# EAGLE schematic CT-ARM (EAGLE 7.4.0)
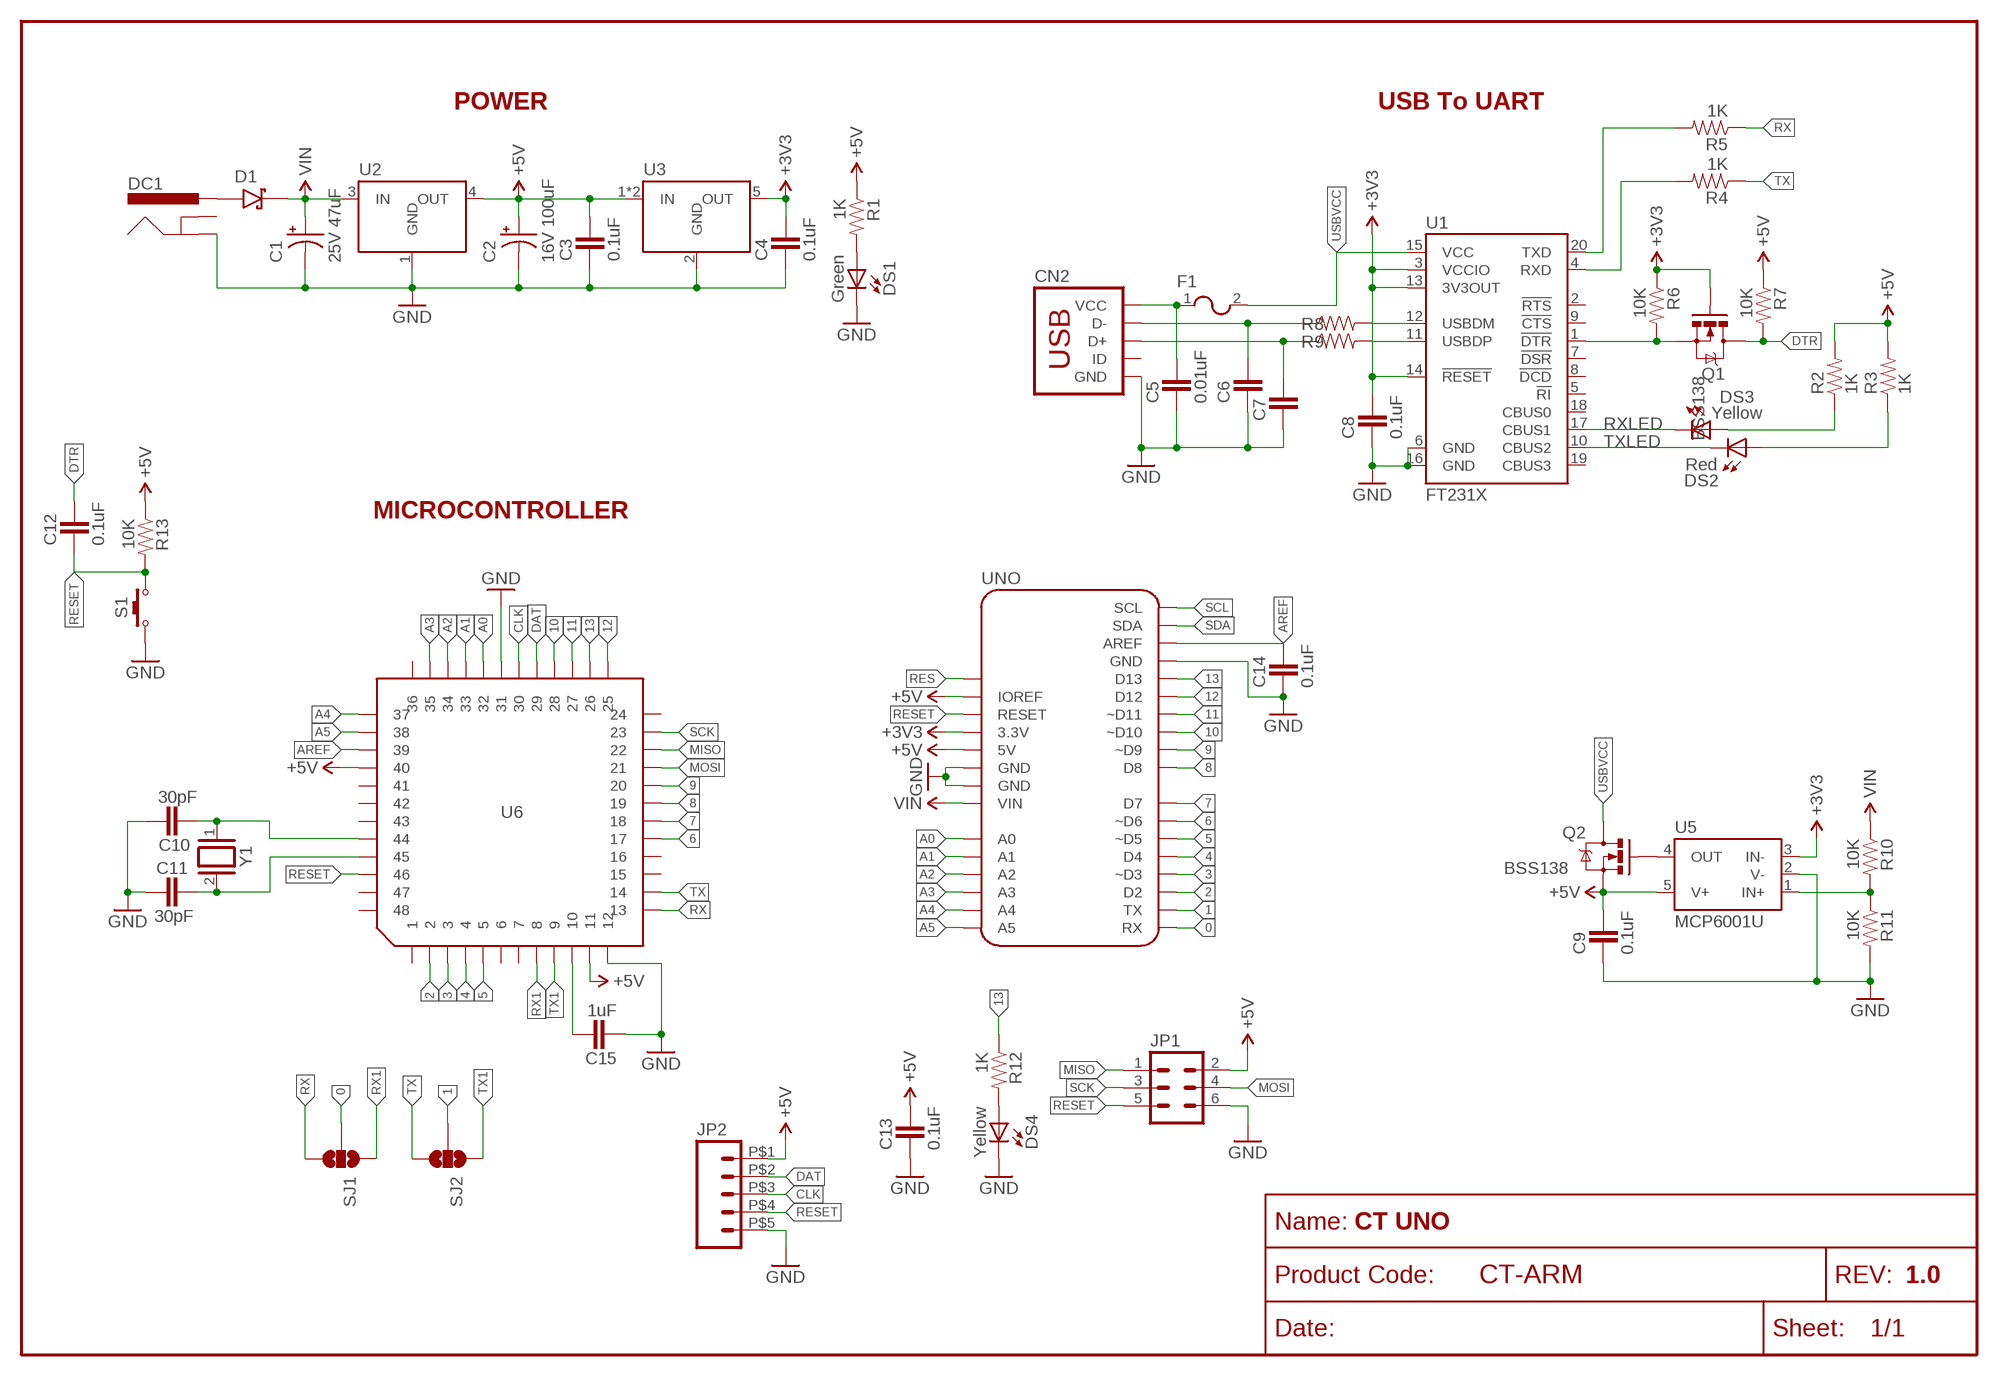
[diagram p0: schematic, sheet 1]

## Parts
C1  25V 47uF  CAP-E-ALUMINIUM_25V47UF_(CHEMICON-F55)  [ECAP-CHEMICON-F]
C2  16V 100uF  CAP-E-ALUMINIUM_16V100UF_(CHEMICON-F55)  [ECAP-CHEMICON-F]
C3  0.1uF  CAP-C_0.1UF_(2012)  [2012]
C4  0.1uF  CAP-C_0.1UF_(2012)  [2012]
C5  0.01uF  CAP-C_0.01UF_(2012)  [2012]
C6  CAP-C_(2012)  [2012]
C7  CAP-C_(2012)  [2012]
C8  0.1uF  CAP-C_0.1UF_(2012)  [2012]
C9  0.1uF  CAP-C_0.1UF_(2012)  [2012]
C10  30pF  CAP-C_30PF_(2012)  [2012]
C11  30pF  CAP-C_30PF_(2012)  [2012]
C12  0.1uF  CAP-C_0.1UF_(2012)  [2012]
C13  0.1uF  CAP-C_0.1UF_(2012)  [2012]
C14  0.1uF  CAP-C_0.1UF_(2012)  [2012]
C15  1uF  CAP-C_1UF_(2012)  [2012]
CN2  USB-5PIN_(MICRO-B-REC)  [USB-MICRO-B-REC]
D1  40V 1A  DIODE-SCHOTTKY_MBRA140T_(SMA)  [D-SMA]
DC1  DC_POWER_JACK_(PTH)  [DC_PLUG_PTH]
DS1  Green  LED_GREEN_(3216)  [LED-3216]
DS2  Red  LED_RED_(3216)  [LED-3216]
DS3  Yellow  LED_YELLOW_(3216)  [LED-3216]
DS4  Yellow  LED_YELLOW_(3216)  [LED-3216]
F1  500mA  FUSE_(4532)  [4532]
JP1  3/40 Ways  HEADER-2X03_(MALE)  [HDR-M2X03]
JP2  HEADER-1X05_(NOSILK)  [HDR-M1X05-NOSILK]
Q1  50V 220mA  MOSFET-N_BSS138_(SOT-23)  [SOT-23]
Q2  50V 220mA  MOSFET-N_BSS138_(SOT-23)  [SOT-23]
R1  1K  RESISTOR_1K_(2012)  [2012]
R2  1K  RESISTOR_1K_(2012)  [2012]
R3  1K  RESISTOR_1K_(2012)  [2012]
R4  1K  RESISTOR_1K_(2012)  [2012]
R5  1K  RESISTOR_1K_(2012)  [2012]
R6  10K  RESISTOR_10K_(2012)  [2012]
R7  10K  RESISTOR_10K_(2012)  [2012]
R8  RESISTOR_(2012)  [2012]
R9  RESISTOR_(2012)  [2012]
R10  10K  RESISTOR_10K_(2012)  [2012]
R11  10K  RESISTOR_10K_(2012)  [2012]
R12  1K  RESISTOR_1K_(2012)  [2012]
R13  10K  RESISTOR_10K_(2012)  [2012]
S1  SW-PB_(KAN0444)  [S-SW-PBM-KAN0444]
SJ1  SOLDERJUMPER_2WAYS  [SJ_3]
SJ2  SOLDERJUMPER_2WAYS  [SJ_3]
U1  FT231XS  [SSOP20_L]
U2  5V  VREG_1117-5.0_(DPAK-GOI)  [DPAK]
U3  3.3V 500mA  VREG_(SOT-23-5)  [SOT-23-5]
U5  5 Pins  MCP6001U_(SOT)  [SOT-23-5]
U6  NUC-48PIN_(48PIN)  [LQFP48]
UNO  ARDUINO-UNO-SHEILD_(UNO)  [ARDUINO-UNO-SHIELD]
Y1  XTAL_(SMD-HC49UP)  [XTAL-HC49UP]

## Nets
0: SJ1.2 UNO.15(RX)
1: SJ2.2 UNO.16(TX)
2: U6.2 UNO.17(D2)
3: U6.3 UNO.18(~D3)
4: U6.4 UNO.19(D4)
5: U6.5 UNO.20(~D5)
6: U6.17 UNO.21(~D6)
7: U6.18 UNO.22(D7)
8: U6.19 UNO.23(D8)
9: U6.20 UNO.24(~D9)
10: U6.28 UNO.25(~D10)
11: U6.27 UNO.26(~D11)
12: U6.25 UNO.27(D12)
13: R12.1 U6.26 UNO.28(D13)
+3V3: C4.1 C8.1 Q1.1(G) R6.1 U1.3(VCCIO) U1.13(3V3OUT) U1.14(!RESET) U3.5(OUT) U5.3(IN-) UNO.4(3.3V)
+5V: C2.+ C3.1 C9.1 C13.1 JP1.2 JP2.P$1 Q2.2(S) R1.1 R2.2 R3.2 R7.1 R13.1 U2.4(OUT) U3.1(IN) U3.3(IN) U5.5(V+) U6.11 U6.40 UNO.2(IOREF) UNO.5(5V)
A0: U6.32 UNO.9(A0)
A1: U6.33 UNO.10(A1)
A2: U6.34 UNO.11(A2)
A3: U6.35 UNO.12(A3)
A4: U6.37 UNO.13(A4)
A5: U6.38 UNO.14(A5)
AREF: C14.1 U6.39 UNO.30(AREF)
CLK: JP2.P$3 U6.30
DAT: JP2.P$2 U6.29
DTR: C12.1 Q1.3(D) R7.2
GND: C1.- C2.- C3.2 C4.2 C5.2 C6.2 C7.2 C8.2 C9.2 C10.1 C11.2 C13.2 C14.2 C15.2 CN2.GND1(GND) DC1.1(GND) DS1.C DS4.C JP1.6 JP2.P$5 R11.2 S1.P$1 U1.6(GND) U1.16(GND) U2.1(GND) U3.2(GND) U5.2(V-) U6.12 U6.31 UNO.6(GND) UNO.7(GND) UNO.29(GND)
MISO: JP1.1 U6.22
MOSI: JP1.4 U6.21
N$1: D1.A DC1.2(PWR)
N$2: DS1.A R1.2
N$3: DS3.A R2.1
N$4: DS3.C U1.17(CBUS1)
N$5: DS2.C U1.10(CBUS2)
N$6: DS2.A R3.1
N$7: R5.2 U1.20(TXD)
N$8: R4.2 U1.4(RXD)
N$9: Q1.2(S) R6.2 U1.1(!DTR)
N$10: R8.2 U1.12(USBDM)
N$11: R9.2 U1.11(USBDP)
N$12: C6.1 CN2.D-1(D-) R8.1
N$13: C7.1 CN2.D+1(D+) R9.1
N$14: R10.2 R11.1 U5.1(IN+)
N$15: DS4.A R12.2
N$16: Q2.1(G) U5.4(OUT)
N$17: C15.1 U6.10
N$18: C5.1 CN2.VBUS1(VCC) F1.1
N$19: C10.2 U6.44 Y1.1
N$20: C11.1 U6.45 Y1.2
RES: UNO.1
RESET: C12.2 JP1.5 JP2.P$4 R13.2 S1.P$2 U6.46 UNO.3(RESET)
RX: R5.1 SJ1.3 U6.13
RX1: SJ1.1 U6.8
SCK: JP1.3 U6.23
SCL: UNO.32(SCL)
SDA: UNO.31(SDA)
TX: R4.1 SJ2.3 U6.14
TX1: SJ2.1 U6.9
USBVCC: F1.2 Q2.3(D) U1.15(VCC)
VIN [power]: C1.+ D1.C R10.1 U2.3(IN) UNO.8(VIN)
Unconnected: CN2.ID1(ID) DC1.3(GNDBREAK) U1.2(!RTS) U1.5(!RI) U1.7(!DSR) U1.8(!DCD) U1.9(!CTS) U1.18(CBUS0) U1.19(CBUS3) U6.1 U6.6 U6.7 U6.15 U6.16 U6.24 U6.36 U6.41 U6.42 U6.43 U6.47 U6.48

## Notes on the sheet
- POWER | USB To UART
- RXLED
- TXLED
- MICROCONTROLLER
- CT UNO
- 1.0

## Library data of the parts
C1 = Others:CAP-E-ALUMINIUM: Aluminium Electrolytic Capacitor Created by: Wai Weng; CYTRON-PC: SMD-EC-25-47UF; DESC: SMD Aluminium Electrolytic Cap; PNP-LIB: CHEMICON-F55
C2 = Others:CAP-E-ALUMINIUM: Aluminium Electrolytic Capacitor Created by: Wai Weng; CYTRON-PC: SMD-EC-16-100UF; DESC: SMD Aluminium Electrolytic Cap; PNP-LIB: CHEMICON-F55
C3 C4 C8 C9 C12-C14 = Others:CAP-C: Ceramic and Multilayer Capacitor; CYTRON-PC: S-CC-100N-85; DESC: SMD Ceramic Capacitor; PNP-LIB: CC2012-T0.7
C5 = Others:CAP-C: Ceramic and Multilayer Capacitor; CYTRON-PC: S-CC-10N-85; DESC: SMD Ceramic Capacitor; PNP-LIB: CC2012-T0.7
C6 C7 = Others:CAP-C: Ceramic and Multilayer Capacitor; CYTRON-PC: S-CC-?-85; DESC: SMD Ceramic Capacitor; PNP-LIB: CC2012-T?
C10 C11 = Others:CAP-C: Ceramic and Multilayer Capacitor; CYTRON-PC: S-CC-30P-85; DESC: SMD Ceramic Capacitor; PNP-LIB: CC2012-T0.7
C15 = Others:CAP-C: Ceramic and Multilayer Capacitor; CYTRON-PC: S-CC-1U-85; DESC: SMD Ceramic Capacitor; PNP-LIB: CC2012-T1.2
CN2 = Header and Connector:USB-5PIN: USB Connector - 5 Pins.; DESC: USB Micro-B Connector Receptacle
D1 = Others:DIODE-SCHOTTKY: Schottky Diode Created by: Wai Weng; CYTRON-PC: SMD-DI-MBRA140T; DESC: SMD Schottky Diode; MPN: MBRA140T; PNP-LIB: D-SMA
DC1 = Header and Connector:DC_POWER_JACK: DC Power Jack (SMD); CYTRON-PC: CN-HL-2527-B; DESC: HL2527 DC Plug (2.1mm) (Black)
DS1 = Others:LED: LED; CYTRON-PC: SMD-LED-G; DESC: SMD LED; PNP-LIB: LED3216
DS2 = Others:LED: LED; CYTRON-PC: SMD-LED-R; DESC: SMD LED; PNP-LIB: LED3216
DS3 DS4 = Others:LED: LED; CYTRON-PC: SMD-LED-Y; DESC: SMD LED; PNP-LIB: LED3216
F1 = Others:FUSE: Fuse; CYTRON-PC: S-PTC-0.5A; DESC: Fuse 500mA; MF: Bourns; MPN: MSMF050
JP1 = Header and Connector:HEADER-2X03: Header - 2X03; CYTRON-PC: CN-PH-M240S; DESC: Male Header - 2x40 Ways
JP2 = Header and Connector:HEADER-1X05: Header - 1X05
Q1 Q2 = IC & Transistor:MOSFET-N: N-Channel MOSFET Created by: Wai Weng; CYTRON-PC: SMD-TR-BSS138; DESC: SMD MOSFET - N Channel; MPN: BSS138; PNP-LIB: SOT23-3
R1-R5 R12 = Others:RESISTOR: Resistor; CYTRON-PC: SMD-RS-1K; DESC: SMD Resistor; PNP-LIB: RS2012
R6 R7 R10 R11 R13 = Others:RESISTOR: Resistor; CYTRON-PC: SMD-RS-10K; DESC: SMD Resistor; PNP-LIB: RS2012
R8 R9 = Others:RESISTOR: Resistor; CYTRON-PC: SMD-RS-?; DESC: SMD Resistor; PNP-LIB: RS2012
S1 = Others:SW-PB: Momentary Push Button; CYTRON-PC: S-SW-PBM-KAN0444; DESC: SMD Push Button - 2 Pins
SJ1 SJ2 = SparkFun-Retired:SOLDERJUMPER_2WAY: Solder Jumper 2 way solder jumper
U1 = IC & Transistor:FT231X: FTDI FT231X Full Speed USB to Full-handshake UART This USB2.0 Full Speed IC offers a compact bridge to full handshake UART interfaces. The device is a UART, capable of operating up to 3MBaud, with low power consumption (8mA). The FT231X includes the complete FT-X series feature set and enables USB to be added into a system design quickly and easily over a UART interface.; CYTRON-PC: SMD-IC-FT231X; DESC: USB to UART; MPN: FT231X
U2 = IC & Transistor:VREG: Voltage Regulator - 3 Pins; CYTRON-PC: SMD-VR-NCP1117; DESC: SMD Voltage Regulator; PNP-LIB: DPAK
U3 = IC & Transistor:VREG: Voltage Regulator - 3 Pins; DESC: SMD Voltage Regulator (LDO)
U5 = IC & Transistor:MCP6001U; CYTRON-PC: SMD-IC-MCP6001U; MPN: MCP6001U
U6 = IC & Transistor:NUC-48PIN; CYTRON-PC: NUC140LD2CN; DESC: NUC140LD2CN
UNO = Header and Connector:ARDUINO-UNO-SHEILD; DESC: Arduino Uno R3 Shield
Y1 = Others:XTAL: Crystal Oscillator; CYTRON-PC: CR-H49SMD-?; DESC: SMD Crystal

## Net classes
0 default: width 0.305 mm, drill 0.381 mm, clearance 0.254 mm
1 power: width 0.381 mm, drill 0.381 mm, clearance 0.305 mm